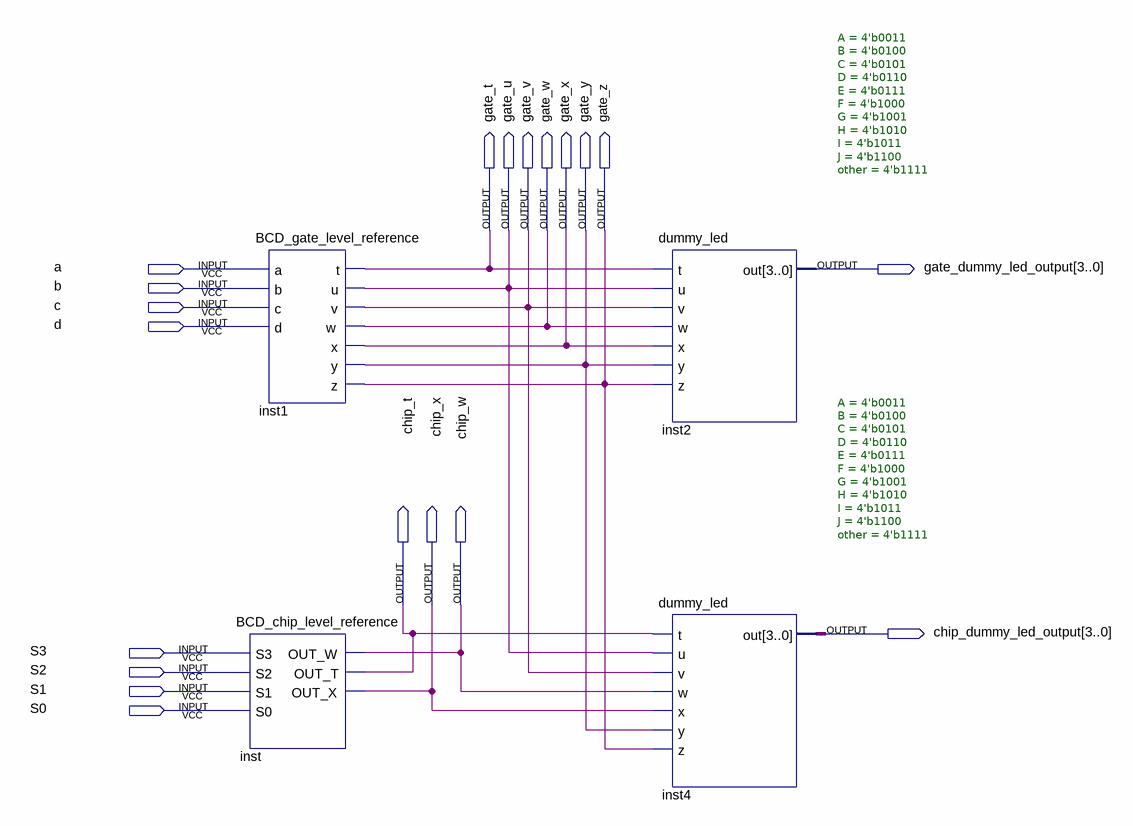
[diagram p0: schematic sheet]
// Quartus schematic basicmoduleP1.bdf as structural Verilog: 4 symbols, 20 pins
module basicmoduleP1 (
  input  a,
  input  b,
  input  c,
  input  d,
  input  S3,
  input  S2,
  input  S1,
  input  S0,
  output gate_t,
  output gate_u,
  output gate_v,
  output gate_w,
  output gate_x,
  output gate_y,
  output gate_z,
  output [3:0] gate_dummy_led_output,
  output chip_t,
  output chip_x,
  output chip_w,
  output [3:0] chip_dummy_led_output
);

  BCD_chip_level_reference inst (.S3(S3), .S2(S2), .S1(S1), .S0(S0), .OUT_W(chip_w), .OUT_T(chip_t), .OUT_X(chip_x));
  BCD_gate_level_reference inst1 (
    .a(a), .b(b), .c(c), .d(d), .t(gate_t), .u(gate_u), .v(gate_v), .w(gate_w), .x(gate_x), .y(gate_y),
    .z(gate_z));
  dummy_led #(.A(4'b0011), .B(4'b0100), .C(4'b0101), .D(4'b0110), .E(4'b0111), .F(4'b1000), .G(4'b1001), .H(4'b1010), .I(4'b1011), .J(4'b1100), .other(4'b1111)) inst2 (
    .t(gate_t), .u(gate_u), .v(gate_v), .w(gate_w), .x(gate_x), .y(gate_y), .z(gate_z),
    .out(gate_dummy_led_output));
  dummy_led #(.A(4'b0011), .B(4'b0100), .C(4'b0101), .D(4'b0110), .E(4'b0111), .F(4'b1000), .G(4'b1001), .H(4'b1010), .I(4'b1011), .J(4'b1100), .other(4'b1111)) inst4 (
    .t(chip_t), .u(gate_u), .v(gate_v), .w(chip_w), .x(chip_x), .y(gate_y), .z(gate_z),
    .out(chip_dummy_led_output));
endmodule
